# EAGLE design Top Board (EAGLE 9.6.2)
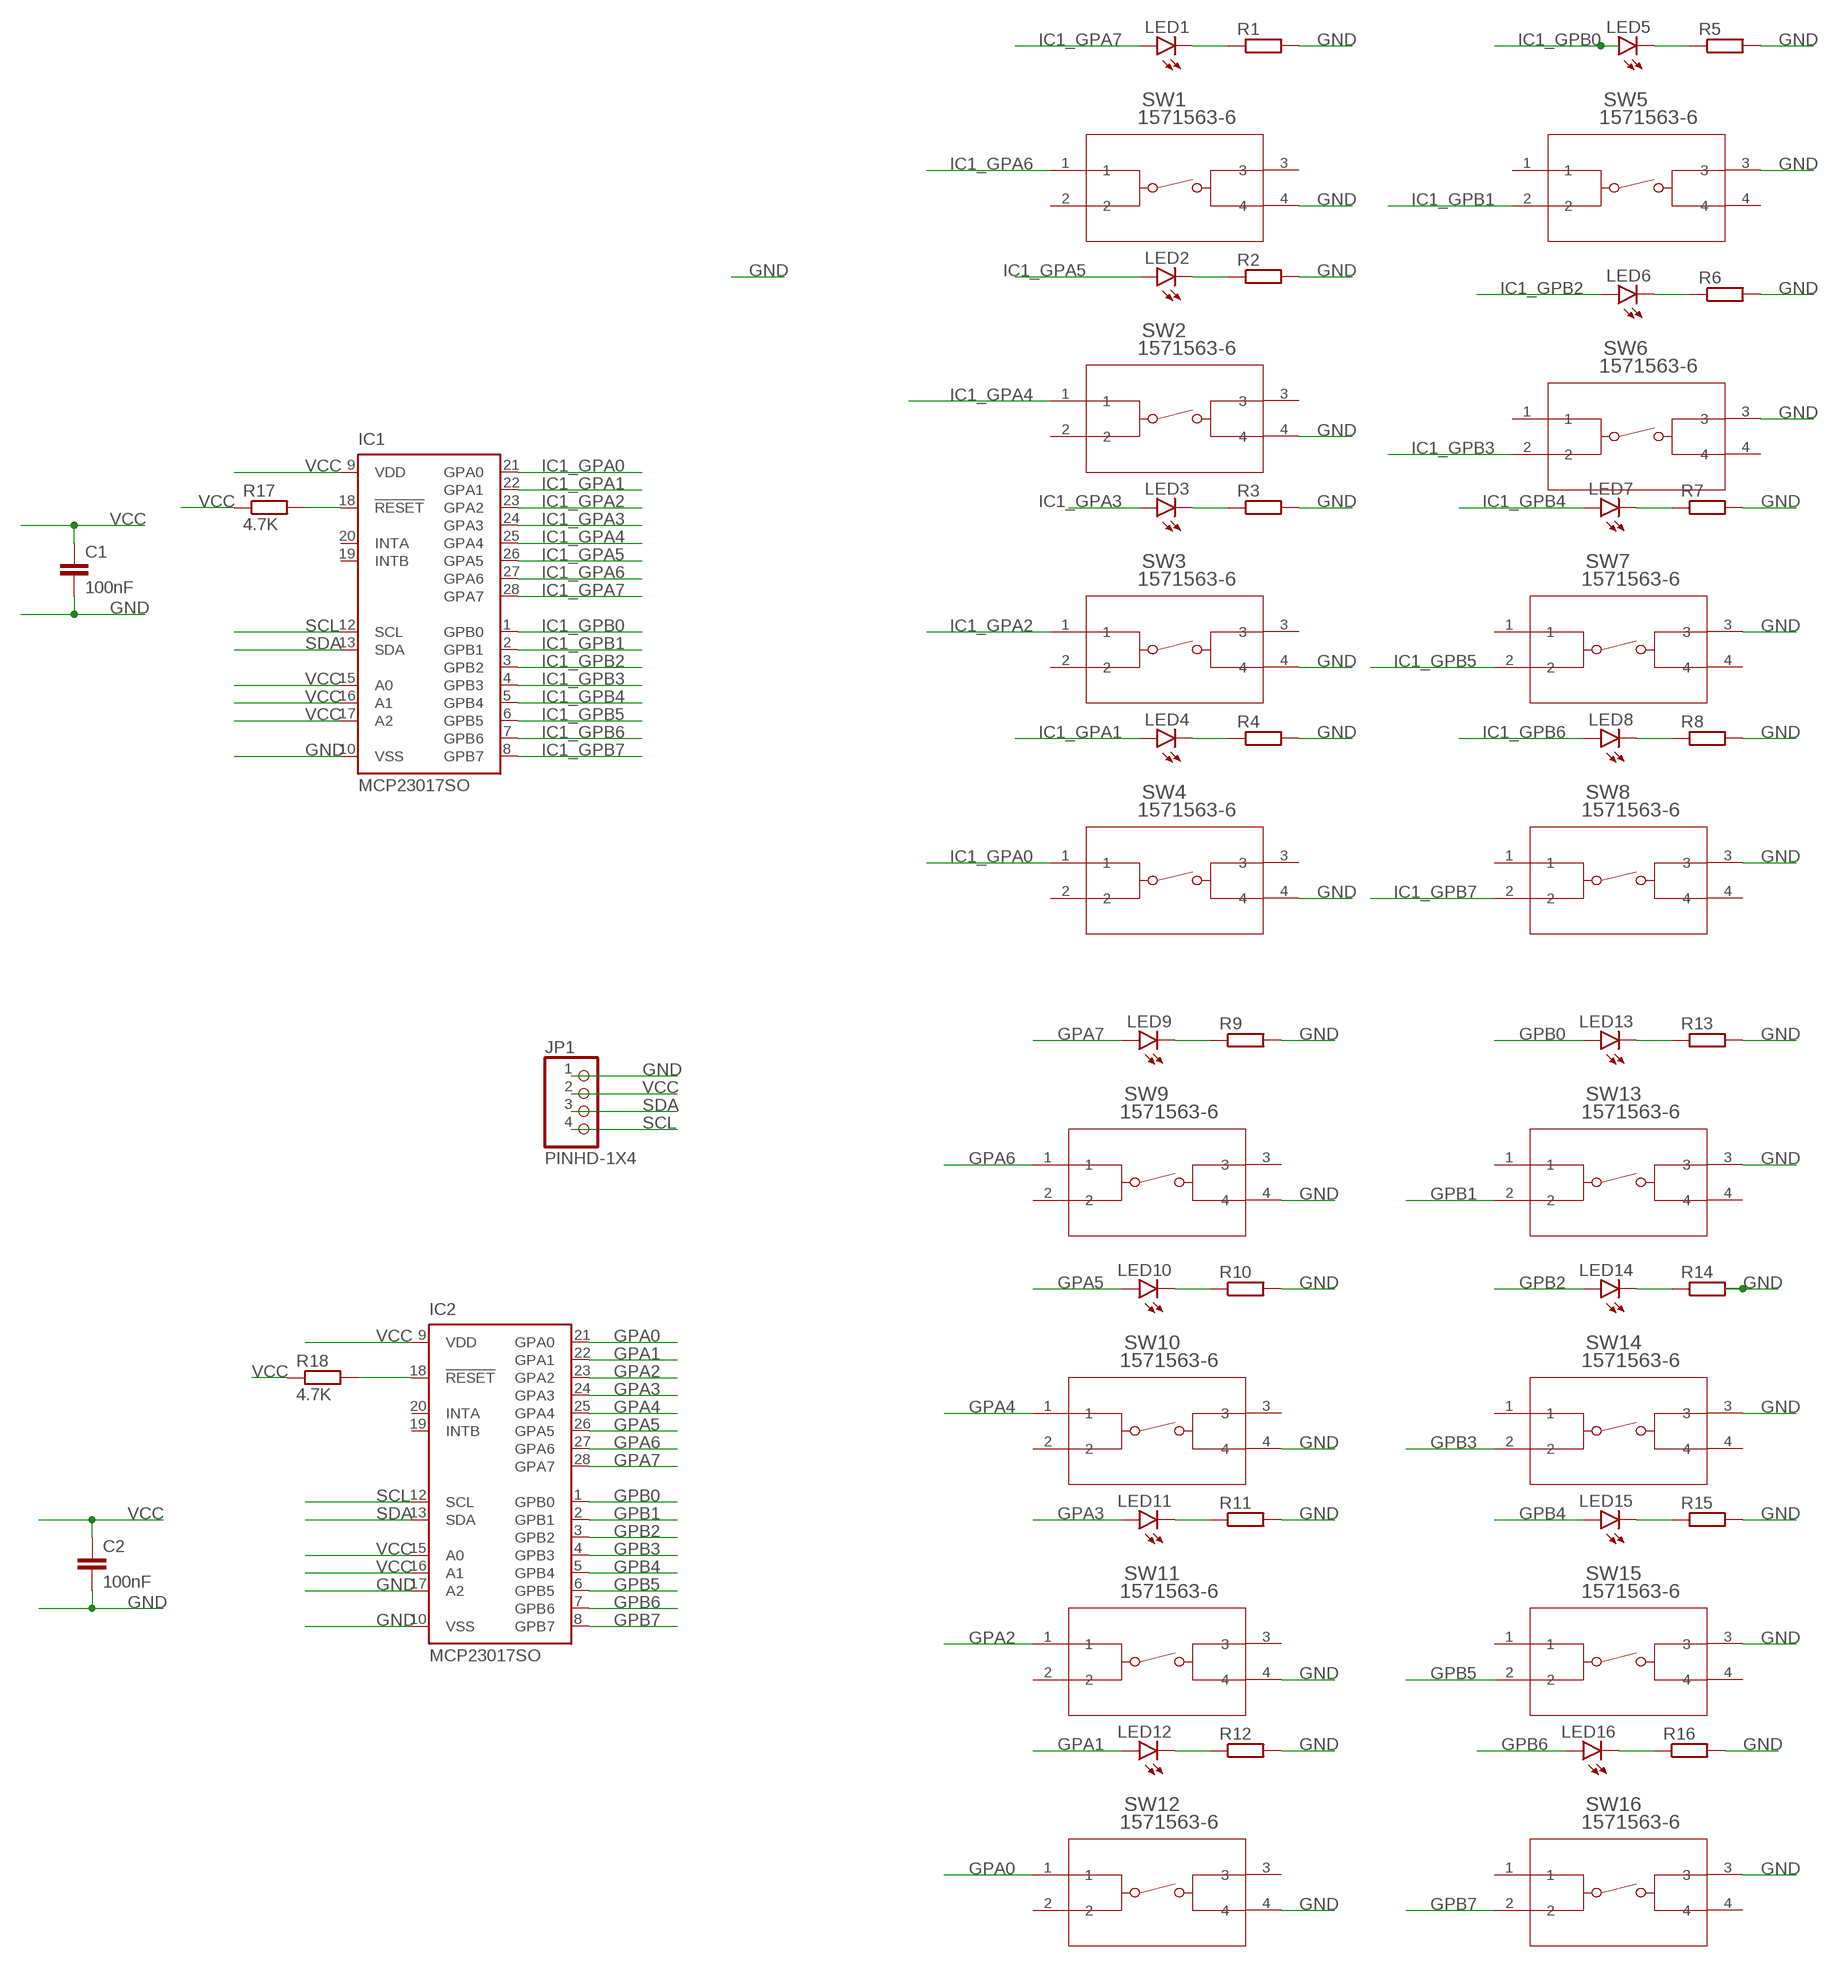
[diagram p0: schematic, sheet 1]

## Parts
C1  100nF  C-EU025-025X050  [C025-025X050]
C2  100nF  C-EU025-025X050  [C025-025X050]
IC1  MCP23017SO  [SO28W]
IC2  MCP23017SO  [SO28W]
JP1  PINHD-1X4  [1X04]
LED1  LEDCHIP-LED0805  [CHIP-LED0805]
LED2  LEDCHIP-LED0805  [CHIP-LED0805]
LED3  LEDCHIP-LED0805  [CHIP-LED0805]
LED4  LEDCHIP-LED0805  [CHIP-LED0805]
LED5  LEDCHIP-LED0805  [CHIP-LED0805]
LED6  LEDCHIP-LED0805  [CHIP-LED0805]
LED7  LEDCHIP-LED0805  [CHIP-LED0805]
LED8  LEDCHIP-LED0805  [CHIP-LED0805]
LED9  LEDCHIP-LED0805  [CHIP-LED0805]
LED10  LEDCHIP-LED0805  [CHIP-LED0805]
LED11  LEDCHIP-LED0805  [CHIP-LED0805]
LED12  LEDCHIP-LED0805  [CHIP-LED0805]
LED13  LEDCHIP-LED0805  [CHIP-LED0805]
LED14  LEDCHIP-LED0805  [CHIP-LED0805]
LED15  LEDCHIP-LED0805  [CHIP-LED0805]
LED16  LEDCHIP-LED0805  [CHIP-LED0805]
R1  R-EU_R0805  [R0805]
R2  R-EU_R0805  [R0805]
R3  R-EU_R0805  [R0805]
R4  R-EU_R0805  [R0805]
R5  R-EU_R0805  [R0805]
R6  R-EU_R0805  [R0805]
R7  R-EU_R0805  [R0805]
R8  R-EU_R0805  [R0805]
R9  R-EU_R0805  [R0805]
R10  R-EU_R0805  [R0805]
R11  R-EU_R0805  [R0805]
R12  R-EU_R0805  [R0805]
R13  R-EU_R0805  [R0805]
R14  R-EU_R0805  [R0805]
R15  R-EU_R0805  [R0805]
R16  R-EU_R0805  [R0805]
R17  4.7K  R-EU_R0805  [R0805]
R18  4.7K  R-EU_R0805  [R0805]
SW1  1571563-6  [SW4_1437565-E]
SW2  1571563-6  [SW4_1437565-E]
SW3  1571563-6  [SW4_1437565-E]
SW4  1571563-6  [SW4_1437565-E]
SW5  1571563-6  [SW4_1437565-E]
SW6  1571563-6  [SW4_1437565-E]
SW7  1571563-6  [SW4_1437565-E]
SW8  1571563-6  [SW4_1437565-E]
SW9  1571563-6  [SW4_1437565-E]
SW10  1571563-6  [SW4_1437565-E]
SW11  1571563-6  [SW4_1437565-E]
SW12  1571563-6  [SW4_1437565-E]
SW13  1571563-6  [SW4_1437565-E]
SW14  1571563-6  [SW4_1437565-E]
SW15  1571563-6  [SW4_1437565-E]
SW16  1571563-6  [SW4_1437565-E]

## Nets
GND: C1.2 C2.2 IC1.10(VSS) IC2.10(VSS) IC2.17(A2) JP1.1 R1.2 R2.2 R3.2 R4.2 R5.2 R6.2 R7.2 R8.2 R9.2 R10.2 R11.2 R12.2 R13.2 R14.2 R15.2 R16.2 SW1.4 SW2.4 SW3.4 SW4.4 SW5.3 SW6.3 SW7.3 SW8.3 SW9.4 SW10.4 SW11.4 SW12.4 SW13.3 SW14.3 SW15.3 SW16.3
GPA0: IC2.21(GPA0) SW12.1
GPA1: IC2.22(GPA1) LED12.A
GPA2: IC2.23(GPA2) SW11.1
GPA3: IC2.24(GPA3) LED11.A
GPA4: IC2.25(GPA4) SW10.1
GPA5: IC2.26(GPA5) LED10.A
GPA6: IC2.27(GPA6) SW9.1
GPA7: IC2.28(GPA7) LED9.A
GPB0: IC2.1(GPB0) LED13.A
GPB1: IC2.2(GPB1) SW13.2
GPB2: IC2.3(GPB2) LED14.A
GPB3: IC2.4(GPB3) SW14.2
GPB4: IC2.5(GPB4) LED15.A
GPB5: IC2.6(GPB5) SW15.2
GPB6: IC2.7(GPB6) LED16.A
GPB7: IC2.8(GPB7) SW16.2
IC1_GPA0: IC1.21(GPA0) SW4.1
IC1_GPA1: IC1.22(GPA1) LED4.A
IC1_GPA2: IC1.23(GPA2) SW3.1
IC1_GPA3: IC1.24(GPA3) LED3.A
IC1_GPA4: IC1.25(GPA4) SW2.1
IC1_GPA5: IC1.26(GPA5) LED2.A
IC1_GPA6: IC1.27(GPA6) SW1.1
IC1_GPA7: IC1.28(GPA7) LED1.A
IC1_GPB0: IC1.1(GPB0) LED5.A
IC1_GPB1: IC1.2(GPB1) SW5.2
IC1_GPB2: IC1.3(GPB2) LED6.A
IC1_GPB3: IC1.4(GPB3) SW6.2
IC1_GPB4: IC1.5(GPB4) LED7.A
IC1_GPB5: IC1.6(GPB5) SW7.2
IC1_GPB6: IC1.7(GPB6) LED8.A
IC1_GPB7: IC1.8(GPB7) SW8.2
N$1: LED1.C R1.1
N$4: LED2.C R2.1
N$7: LED3.C R3.1
N$10: LED4.C R4.1
N$13: LED5.C R5.1
N$16: LED6.C R6.1
N$19: LED7.C R7.1
N$22: LED8.C R8.1
N$25: LED9.C R9.1
N$28: LED10.C R10.1
N$31: LED11.C R11.1
N$34: LED12.C R12.1
N$37: LED13.C R13.1
N$40: LED14.C R14.1
N$43: LED15.C R15.1
N$46: LED16.C R16.1
N$49: IC2.18(!RESET) R18.2
N$51: IC1.18(!RESET) R17.2
SCL: IC1.12(SCL) IC2.12(SCL) JP1.4
SDA: IC1.13(SDA) IC2.13(SDA) JP1.3
VCC: C1.1 C2.1 IC1.9(VDD) IC1.15(A0) IC1.16(A1) IC1.17(A2) IC2.9(VDD) IC2.15(A0) IC2.16(A1) JP1.2 R17.1 R18.1
Unconnected: IC1.19(INTB) IC1.20(INTA) IC2.19(INTB) IC2.20(INTA) SW1.2 SW1.3 SW2.2 SW2.3 SW3.2 SW3.3 SW4.2 SW4.3 SW5.1 SW5.4 SW6.1 SW6.4 SW7.1 SW7.4 SW8.1 SW8.4 SW9.2 SW9.3 SW10.2 SW10.3 SW11.2 SW11.3 SW12.2 SW12.3 SW13.1 SW13.4 SW14.1 SW14.4 SW15.1 SW15.4 SW16.1 SW16.4

## Library data of the parts
C1 C2 = rcl:C-EU: CAPACITOR, European symbol; SPICEPREFIX: C
IC1 IC2 = microchip:MCP23017: http://ww1.microchip.com/downloads/en/DeviceDoc/21952a.pdf Source: http://ww1.microchip.com/downloads/en/DeviceDoc/21952a.pdf; MF: MICROCHIP; MPN: MCP23017-E/SO; OC_FARNELL: 1332087; OC_NEWARK: 31K2958
JP1 = Connector:PINHD-1X4: PIN HEADER; CATEGORY: CONNECTOR; SUB-CATEGORY: PIN-HEADER
LED1-LED16 = led:LED: LED OSRAM: - CHIPLED LG R971, LG N971, LY N971, LG Q971, LY Q971, LO R971, LY R971 LH N974, LH R974 LS Q976, LO Q976, LY Q976 LO Q996 - Hyper CHIPLED LW Q18S LB Q993, LB Q99A, LB R99A - SideLED LS A670, LO A670, LY A670, LG A670, LP A670 LB A673, LV A673, LT A673, LW A673 LH A674 LY A675 LS A676, LA A676, LO A676, LY A676, LW A676 LS A679, LY A679, LG A679 - Hyper Micro SIDELED® LS Y876, LA Y876, LO Y876, LY Y876 LT Y87S - SmartLED LW L88C, LW L88S LB L89C, LB L89S, LG L890 LS L89K, LO L89K, LY L89K LS L896, LA L896, LO L896, LY L896 - TOPLED LS T670, LO T670, LY T670, LG T670, LP T670 LSG T670, LSP T670, LSY T670, LOP T670, LYG T670 LG T671, LOG T671, LSG T671 LB T673, LV T673, LT T673, LW T673 LH T674 LS T676, LA T676, LO T676, LY T676, LB T676, LH T676, LSB T676, LW T676 LB T67C, LV T67C, LT T67C, LS T67K, LO T67K, LY T67K, LW E67C LS E67B, LA E67B, LO E67B, LY E67B, LB E67C, LV E67C, LT E67C LW T67C LS T679, LY T679, LG T679 LS T770, LO T770, LY T770, LG T770, LP T770 LB T773, LV T773, LT T773, LW T773 LH T774 LS E675, LA E675, LY E675, LS T675 LS T776, LA T776, LO T776, LY T776, LB T776 LHGB T686 LT T68C, LB T68C - Hyper Mini TOPLED® LB M676 - Mini TOPLED Santana® LG M470 LS M47K, LO M47K, LY M47K Source: http://www.osram.convergy.de LUXEON: - LUMILED® LXK2-PW12-R00, LXK2-PW12-S00, LXK2-PW14-U00, LXK2-PW14-V00 LXK2-PM12-R00, LXK2-PM12-S00, LXK2-PM14-U00 LXK2-PE12-Q00, LXK2-PE12-R00, LXK2-PE12-S00, LXK2-PE14-T00, LXK2-PE14-U00 LXK2-PB12-K00, LXK2-PB12-L00, LXK2-PB12-M00, LXK2-PB14-N00, LXK2-PB14-P00, LXK2-PB14-Q00 LXK2-PR12-L00, LXK2-PR12-M00, LXK2-PR14-Q00, LXK2-PR14-R00 LXK2-PD12-Q00, LXK2-PD12-R00, LXK2-PD12-S00 LXK2-PH12-R00, LXK2-PH12-S00 LXK2-PL12-P00, LXK2-PL12-Q00, LXK2-PL12-R00 Source: www.luxeon.com KINGBRIGHT: KA-3528ASYC Source: www.kingbright.com
R1-R18 = rcl:R-EU_: RESISTOR, European symbol; SPICEPREFIX: R
SW1-SW16 = Switches:1571563-6; BUILT_BY: EMA_UL_Team; CATEGORY: Tactile Switches; COPYRIGHT: Copyright (C) 2016 Accelerated Designs. All rights reserved; DESCRIPTION: FSM14JSMAATR=TACT,SMT,T&R; MANUFACTURER_PART_NUMBER: 1571563-6; PART_STATUS: active; SERIES: Alcoswitch FSMJSMA; VENDOR: TE Connectivity

## Board
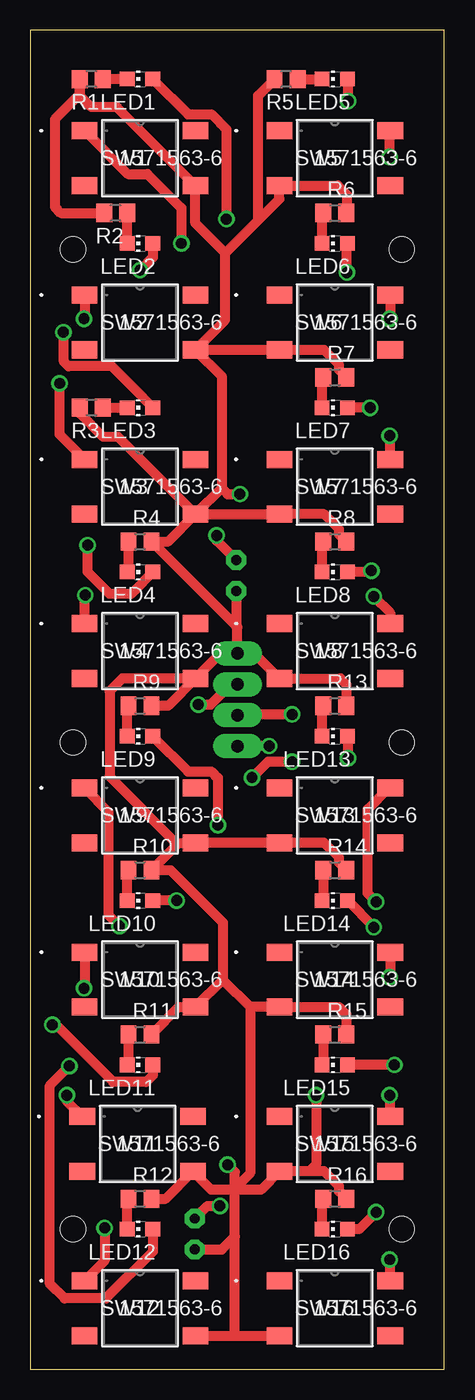
[diagram p1: board, top side]
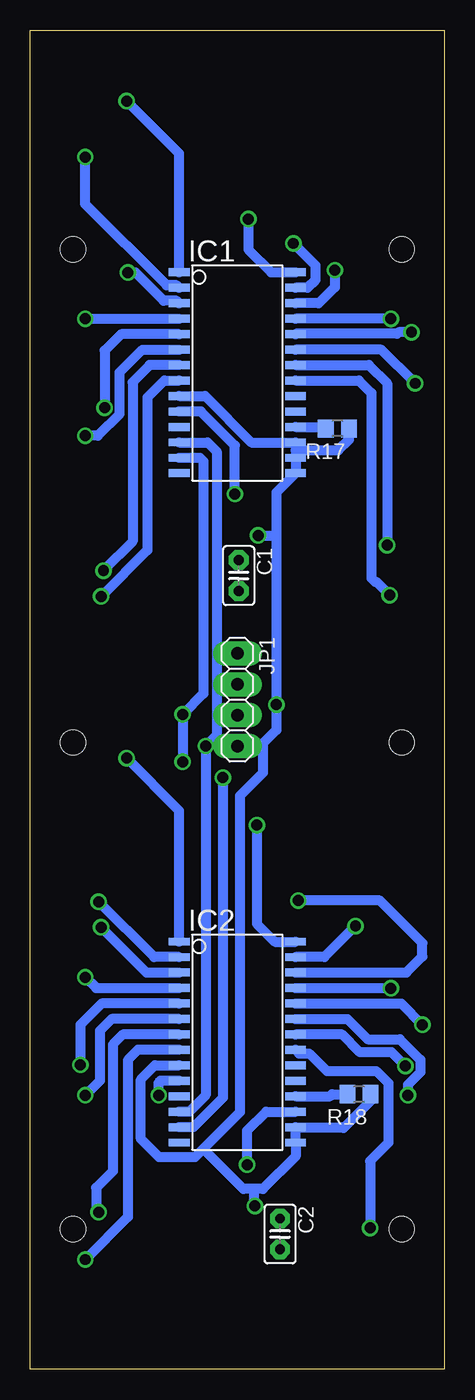
[diagram p2: board, bottom side, seen from below]

Size 34 x 110 mm. Coordinates in mm from the lower left corner, seen from the top.
Outline: 0,110 0,0 34,0 34,110 0,110
Copper layers (1*16): Top 0.035mm / dielectric 1.5mm / Bottom 0.035mm
Design rules "swidzi_milling_3018_smd_test": minimum track width 20mil, minimum drill 0.8mm, track to track 0.25mm, track to pad 0.25mm, pad to pad 0.25mm, via to via 6mil, smd to smd 6mil, copper to edge 15mil, drill to drill 6mil, minimum pad ring 10mil, minimum via ring 8mil, stop-mask expansion 4mil, vias tented up to drill 0mil, thermal gap 10mil
Holes 2.05 mm at 3.5,11.5 30.5,11.5 3.5,51.5 30.5,51.5 3.5,92 30.5,92

### Footprints (pad centres in the part's own frame; a part is rotated, then mirrored left to right if it is on the bottom)
C025-025X050 = drill 0.813 octagon: 1 -1.27,0; 2 1.27,0
SO28W = smd 0.65 x 1.7: 1 -7.62,-4.78; 2 -6.35,-4.78; 3 -5.08,-4.78; 4 -3.81,-4.78; 5 -2.54,-4.78; 6 -1.27,-4.78; 7 0,-4.78; 8 1.27,-4.78; 9 2.54,-4.78; 10 3.81,-4.78; 11 5.08,-4.78; 12 6.35,-4.78; 13 7.62,-4.78; 14 8.89,-4.78; 15 8.89,4.78; 16 7.62,4.78; 17 6.35,4.78; 18 5.08,4.78; 19 3.81,4.78; 20 2.54,4.78; 21 1.27,4.78; 22 0,4.78; 23 -1.27,4.78; 24 -2.54,4.78; 25 -3.81,4.78; 26 -5.08,4.78; 27 -6.35,4.78; 28 -7.62,4.78
1X04 = drill 1.016 long: 1 -3.81,0; 2 -1.27,0; 3 1.27,0; 4 3.81,0
CHIP-LED0805 = smd 1.2 x 1.2: A 0,-1.05; C 0,1.05
R0805 = smd 1.3 x 1.5: 1 -0.95,0; 2 0.95,0
SW4_1437565-E = smd 2.108 x 1.397: 1 -4.55,2.25; 2 4.55,2.25; 3 -4.55,-2.25; 4 4.55,-2.25

### Placement (x,y rotation side)
C1  16.9,65.2 270 bottom
C2  13.5,11.1 270 bottom
IC1  17,82.5 270 bottom
IC2  17,27.5 270 bottom
JP1  17,55 270 bottom
LED1  9,106 90 top
LED2  9,92.5 90 top
LED3  9,79 90 top
LED4  9,65.5 90 top
LED5  25,106 90 top
LED6  25,92.5 90 top
LED7  25,79 90 top
LED8  25,65.5 90 top
LED9  9,52 90 top
LED10  9,38.5 90 top
LED11  9,25 90 top
LED12  9,11.5 90 top
LED13  25,52 90 top
LED14  25,38.5 90 top
LED15  25,25 90 top
LED16  25,11.5 90 top
R1  5,106 180 top
R2  7,95 180 top
R3  5,79 180 top
R4  9,68 0 top
R5  21,106 180 top
R6  25,95 0 top
R7  25,81.5 0 top
R8  25,68 0 top
R9  9,54.5 0 top
R10  9,41 0 top
R11  9,27.5 0 top
R12  9,14 0 top
R13  25,54.5 0 top
R14  25,41 0 top
R15  25,27.5 0 top
R16  25,14 0 top
R17  8.78,77.29 180 bottom
R18  7.01,22.59 180 bottom
SW1  9,99.5 0 top
SW2  9,86 0 top
SW3  9,72.5 0 top
SW4  9,59 0 top
SW5  25,99.5 0 top
SW6  25,86 0 top
SW7  25,72.5 0 top
SW8  25,59 0 top
SW9  9,45.5 0 top
SW10  9,32 0 top
SW11  8.8,18.5 0 top
SW12  9,5 0 top
SW13  25,45.5 0 top
SW14  25,32 0 top
SW15  25,18.5 0 top
SW16  25,5 0 top

### Tracks (layer width: path | path; a pad name or v marks a point on that pad's centre or on a via)
GND  (via drill 0.9)
  Top 0.813: JP1.1 17,60.95 16.9,61.05 | 16.9,61.05 R4.2 11.3,68 SW3.4 | SW3.4 SW7.3 24.13,70.25 25.36,69.02 25.36,68.59 R8.2 | SW2.4 16,86.2 16,91.7 | 16,91.7 13.55,94.15 SW1.4 7.1,103.7 5,103.7 4.05,104.65 R1.2 4.05,104.75 2,102.7 2,95.5 2.5,95 R2.2 | 16,91.7 18.7,94.4 | 18.7,94.4 20.45,96.15 SW5.3 25.25,97.25 26,96.5 26,95.05 R6.2 | SW2.4 SW6.3 24.13,83.75 25.36,82.52 25.36,82.09 R7.2 | 18.7,94.4 18.7,104.65 R5.2 | SW3.4 7.2,76.6 6,76.6 4.05,78.55 R3.2 | SW4.4 15.61,58.81 JP1.1 | JP1.1 18.39,58.81 SW8.3 25.45,56.75 25.95,56.25 R13.2 | SW4.4 11.3,54.5 R9.2 | 15.7,72.4 SW3.4 | SW2.4 15.7,81.6 15.7,72.4 | 15.7,72.4 16.2,71.9 v17.2,71.9 | R11.2 12.2,29.75 SW10.4 15.8,32 | SW4.4 7.55,56.75 6.5,55.7 6.5,48.7 11.95,43.25 | 11.95,43.25 SW9.4 SW13.3 24.13,43.25 25.36,42.02 25.36,41.59 R14.2 | 11.95,43.25 11.95,43 R10.2 11.5,41 15.8,36.7 15.8,32 | 18.05,29.75 SW14.3 25.35,29.75 25.95,29.15 R15.2 | 15.8,32 18.05,29.75 | SW12.4 16.8,2.75 | 16.8,2.75 SW16.3 | R12.2 11.1,14 SW11.4 14.85,14.75 16.7,14.75 | 16.7,14.75 18.95,14.75 SW15.3 22.9,16.25 | 16.7,14.75 16.8,14.65 | 16.8,2.75 16.8,10.9 | 16.8,10.9 16.8,14.65 | R16.2 25.36,14.59 25.36,15.02 24.13,16.25 22.9,16.25 | 18.05,29.75 18.05,16.1 16.7,14.75 | 16.8,14.65 16.8,16.2 v16.2,16.8 | v23.46,22.5 23.46,16.81 22.9,16.25 | C1.2 16.9,61.05 | C2.2 15.73,9.83 16.8,10.9
  Bottom 0.813: v17.2,71.9 17.2,75.9 19.99,78.69 IC1.10 | v16.2,16.8 16.2,19.6 14.65,21.15 IC2.17 | IC2.10 23.31,23.69 23.5,23.5 23.5,22.54 v23.46,22.5
GPA0  (via drill 0.9)
  Top 0.813: v6.1,11.6 6.1,8.9 SW12.1
  Bottom 0.813: IC2.21 11.93,25.94 11.1,25.94 9.66,24.5 5.6,24.5 4.6,23.5 4.6,18.6 6.1,17.1 v6.1,11.6
GPA1  (via drill 0.9)
  Top 0.813: LED12.A 10.05,9.65 6.2,5.8 2.8,5.8 1.6,7 1.6,23.3 v3.2,24.9
  Bottom 0.813: IC2.22 8.4,27.5 6.94,26.04 4.34,26.04 v3.2,24.9
GPA2  (via drill 0.9)
  Top 0.813: v3,22.5 3,22 SW11.1
  Bottom 0.813: IC2.23 7.97,28.77 6.3,27.1 3.65,27.1 1.97,25.41 1.97,24.39 3,23.36 v3,22.5
GPA3  (via drill 0.9)
  Top 0.813: LED11.A 10.05,24.15 9.5,23.6 6.8,23.6 2.1,28.3 v1.8,28.3
  Bottom 0.813: v1.8,28.3 3.54,30.04 IC2.24
GPA4  (via drill 0.9)
  Top 0.813: SW10.1 4.45,31.35 v4.4,31.3
  Bottom 0.813: v4.4,31.3 IC2.25
GPA5  (via drill 0.9)
  Top 0.813: v12,38.5 LED10.A
  Bottom 0.813: IC2.26 3.12,32.58 1.8,33.9 1.8,35 5.3,38.5 v12,38.5
GPA6  (via drill 0.9)
  Top 0.813: SW9.1 6.4,45.8 6.4,37.3 v7.3,36.4
  Bottom 0.813: v7.3,36.4 9.85,33.85 IC2.27
GPA7  (via drill 0.9)
  Top 0.813: LED9.A 12.95,49.1 14.88,49.1 15.4,48.58 v15.4,44.7
  Bottom 0.813: v15.4,44.7 15.4,36.6 13.92,35.12 IC2.28
GPB0  (via drill 0.9)
  Top 0.813: v26.1,50.2 26.1,51.95 LED13.A
  Bottom 0.813: IC2.1 21.78,45.88 v26.1,50.2
GPB1  (via drill 0.9)
  Top 0.813: v28.4,38.4 27.7,39.1 27.7,46 29.45,47.75 SW13.2
  Bottom 0.813: IC2.2 23.85,33.85 v28.4,38.4
GPB2  (via drill 0.9)
  Top 0.813: LED14.A 28.2,36.35 v28.2,36.3
  Bottom 0.813: v28.2,36.3 24.48,32.58 IC2.3
GPB3  (via drill 0.9)
  Top 0.813: SW14.2 29.55,32.25 v29.5,32.2
  Bottom 0.813: v29.5,32.2 28.61,31.31 IC2.4
GPB4  (via drill 0.9)
  Top 0.813: v29.9,25 LED15.A
  Bottom 0.813: IC2.5 28.16,30.04 29.9,28.3 v29.9,25
GPB5  (via drill 0.9)
  Top 0.813: v29.5,22.5 29.5,20.8 SW15.2
  Bottom 0.813: IC2.6 27.33,28.77 28.3,27.8 28.3,23.7 v29.5,22.5
GPB6  (via drill 0.9)
  Top 0.813: v28.4,12.9 27,11.5 LED16.A
  Bottom 0.813: IC2.7 26.4,27.5 27.24,26.66 27.24,16.26 28.6,14.9 28.6,13.1 v28.4,12.9
GPB7  (via drill 0.9)
  Top 0.813: v29.5,9 29.5,7.3 SW16.2
  Bottom 0.813: IC2.8 25.17,26.23 26,25.4 26,12.5 v29.5,9
IC1_GPA0  (via drill 0.9)
  Top 0.813: SW4.1 4.45,63.55 v4.5,63.6
  Bottom 0.813: IC1.21 7.03,81.23 6,80.2 6,65 5.7,64.7 5.6,64.7 v4.5,63.6
IC1_GPA1  (via drill 0.9)
  Top 0.813: LED4.A 9.21,64.66 9.21,64.63 8.28,63.7 6.5,63.7 4.7,65.5 v4.7,67.7
  Bottom 0.813: IC1.22 6.2,82.5 4.7,81 v4.7,67.7
IC1_GPA2  (via drill 0.9)
  Top 0.813: SW3.1 2.4,76.8 v2.4,81
  Bottom 0.813: v2.4,81 5.17,83.77 IC1.23
IC1_GPA3  (via drill 0.9)
  Top 0.813: LED3.A 9.21,79.84 9.21,79.87 6.68,82.39 3.12,82.39 2.74,82.78 2.74,85.16 v2.7,85.2
  Bottom 0.813: v2.7,85.2 3.75,85.2 3.89,85.07 12.19,85.07 IC1.24
IC1_GPA4  (via drill 0.9)
  Top 0.813: SW2.1 4.45,86.35 v4.4,86.3
  Bottom 0.813: v4.4,86.3 IC1.25
IC1_GPA5  (via drill 0.9)
  Top 0.813: LED2.A 10.05,91.35 v9,90.3
  Bottom 0.813: v9,90.3 9,88.9 10.32,87.58 IC1.26
IC1_GPA6  (via drill 0.9)
  Top 0.813: SW1.1 8,98.2 9.6,98.2 12.4,95.4 v12.4,92.5
  Bottom 0.813: v12.4,92.5 10.6,90.7 10.6,89.5 11.25,88.85 IC1.27
IC1_GPA7  (via drill 0.9)
  Top 0.813: LED1.A 12.95,103.11 14.88,103.11 16.1,101.88 v16.1,94.5
  Bottom 0.813: v16.1,94.5 16.1,92 14.22,90.12 IC1.28
IC1_GPB0  (via drill 0.9)
  Top 0.813: v26.1,104.2 26.1,105.95 LED5.A
  Bottom 0.813: IC1.1 21.78,99.88 v26.1,104.2
IC1_GPB1  (via drill 0.9)
  Top 0.813: v29.5,99.6 29.5,101.7 SW5.2
  Bottom 0.813: IC1.2 21.99,89.06 22.82,89.06 29.5,95.74 v29.5,99.6
IC1_GPB2  (via drill 0.9)
  Top 0.813: v26,90.1 26,92.45 LED6.A
  Bottom 0.813: IC1.3 21.99,87.79 23.05,87.79 25.37,90.1 v26,90.1
IC1_GPB3  (via drill 0.9)
  Top 0.813: SW6.2 29.55,86.35 v29.5,86.3
  Bottom 0.813: v29.5,86.3 IC1.4
IC1_GPB4  (via drill 0.9)
  Top 0.813: v27.9,79 LED7.A
  Bottom 0.813: IC1.5 26.56,85.04 27.9,83.7 v27.9,79
IC1_GPB5  (via drill 0.9)
  Top 0.813: v29.5,76.7 29.5,74.8 SW7.2
  Bottom 0.813: v29.5,76.7 28.45,76.7 26.67,78.49 26.67,81.92 24.81,83.77 IC1.6
IC1_GPB6  (via drill 0.9)
  Top 0.813: v28,65.6 27.9,65.5 LED8.A
  Bottom 0.813: IC1.7 24.2,82.5 25.6,81.1 25.6,68 v28,65.6
IC1_GPB7  (via drill 0.9)
  Top 0.813: v28.2,63.5 29.55,62.15 SW8.2
  Bottom 0.813: IC1.8 21.79,81.24 23,81.24 24.4,79.84 24.4,67.3 v28.2,63.5
N$1
  Top 0.813: LED1.C R1.1
N$4
  Top 0.813: LED2.C R2.1
N$7
  Top 0.813: R3.1 LED3.C
N$10
  Top 0.813: R4.1 8.05,65.6 LED4.C
N$13
  Top 0.813: R5.1 LED5.C
N$16
  Top 0.813: LED6.C 23.95,94.9 R6.1
N$19
  Top 0.813: LED7.C 23.95,81.4 R7.1
N$22
  Top 0.813: LED8.C 23.95,67.9 R8.1
N$25
  Top 0.813: LED9.C 7.95,54.4 R9.1
N$28
  Top 0.813: LED10.C 7.95,40.9 R10.1
N$31
  Top 0.813: R11.1 8.05,25.1 LED11.C
N$34
  Top 0.813: LED12.C 7.95,13.9 R12.1
N$37
  Top 0.813: LED13.C 23.95,54.4 R13.1
N$40
  Top 0.813: R14.1 24.05,38.6 LED14.C
N$43
  Top 0.813: R15.1 24.05,25.1 LED15.C
N$46
  Top 0.813: LED16.C 23.95,13.9 R16.1
N$49
  Bottom 0.813: R18.2 9.21,22.59 9.38,22.42 IC2.18
N$51
  Bottom 0.813: IC1.18 9.86,77.42 R17.2
SCL  (via drill 0.9)
  Top 0.813: v19.6,51.2 JP1.4
  Bottom 0.813: IC1.12 19.45,76.15 18.7,75.4 18.7,52.1 v19.6,51.2 19.6,22.5 20.27,21.83 20.27,21.82 20.95,21.15 IC2.12
SDA  (via drill 0.9)
  Top 0.813: v21.5,53.8 17.07,53.8 JP1.3 | v21.5,49.9 19.5,49.9 v18.2,48.6
  Bottom 0.813: IC1.13 20.08,74.88 19.8,74.6 19.8,55.5 v21.5,53.8 v21.5,49.9 | v18.2,48.6 18.2,22.3 20.62,19.88 IC2.13
VCC  (via drill 0.9)
  Top 0.813: JP1.2 16.47,56.27 14.8,54.6 v13.8,54.6 | C1.1 15.3,68.07 v15.3,68.5 | C2.1 14.53,13.4 v15.57,13.4
  Bottom 0.813: 12.22,75.5 IC1.17 15.85,76.15 19.66,79.96 IC1.9 | 12.22,75.5 IC1.16 IC1.15 13.8,72.03 13.8,68.5 | 12.22,75.5 8.7,75.5 7.83,76.37 R17.1 | 13.8,68.5 v13.8,54.6 13.8,52.5 14.9,51.4 14.9,49 16.8,47.1 16.8,21.1 19.8,18.1 | R18.1 6.06,22.04 8.3,19.8 8.38,19.88 IC2.16 IC2.15 12.22,17.48 14.9,14.8 15.6,14.8 | IC2.9 23.78,24.96 24.94,23.8 24.94,18.9 23.44,17.4 20.5,17.4 19.8,18.1 | 19.8,18.1 16.5,14.8 15.6,14.8 | v15.3,68.5 13.8,68.5 | v15.57,13.4 15.6,13.43 15.6,14.8